# EAGLE schematic H-API_SVF (EAGLE 9.1.3)
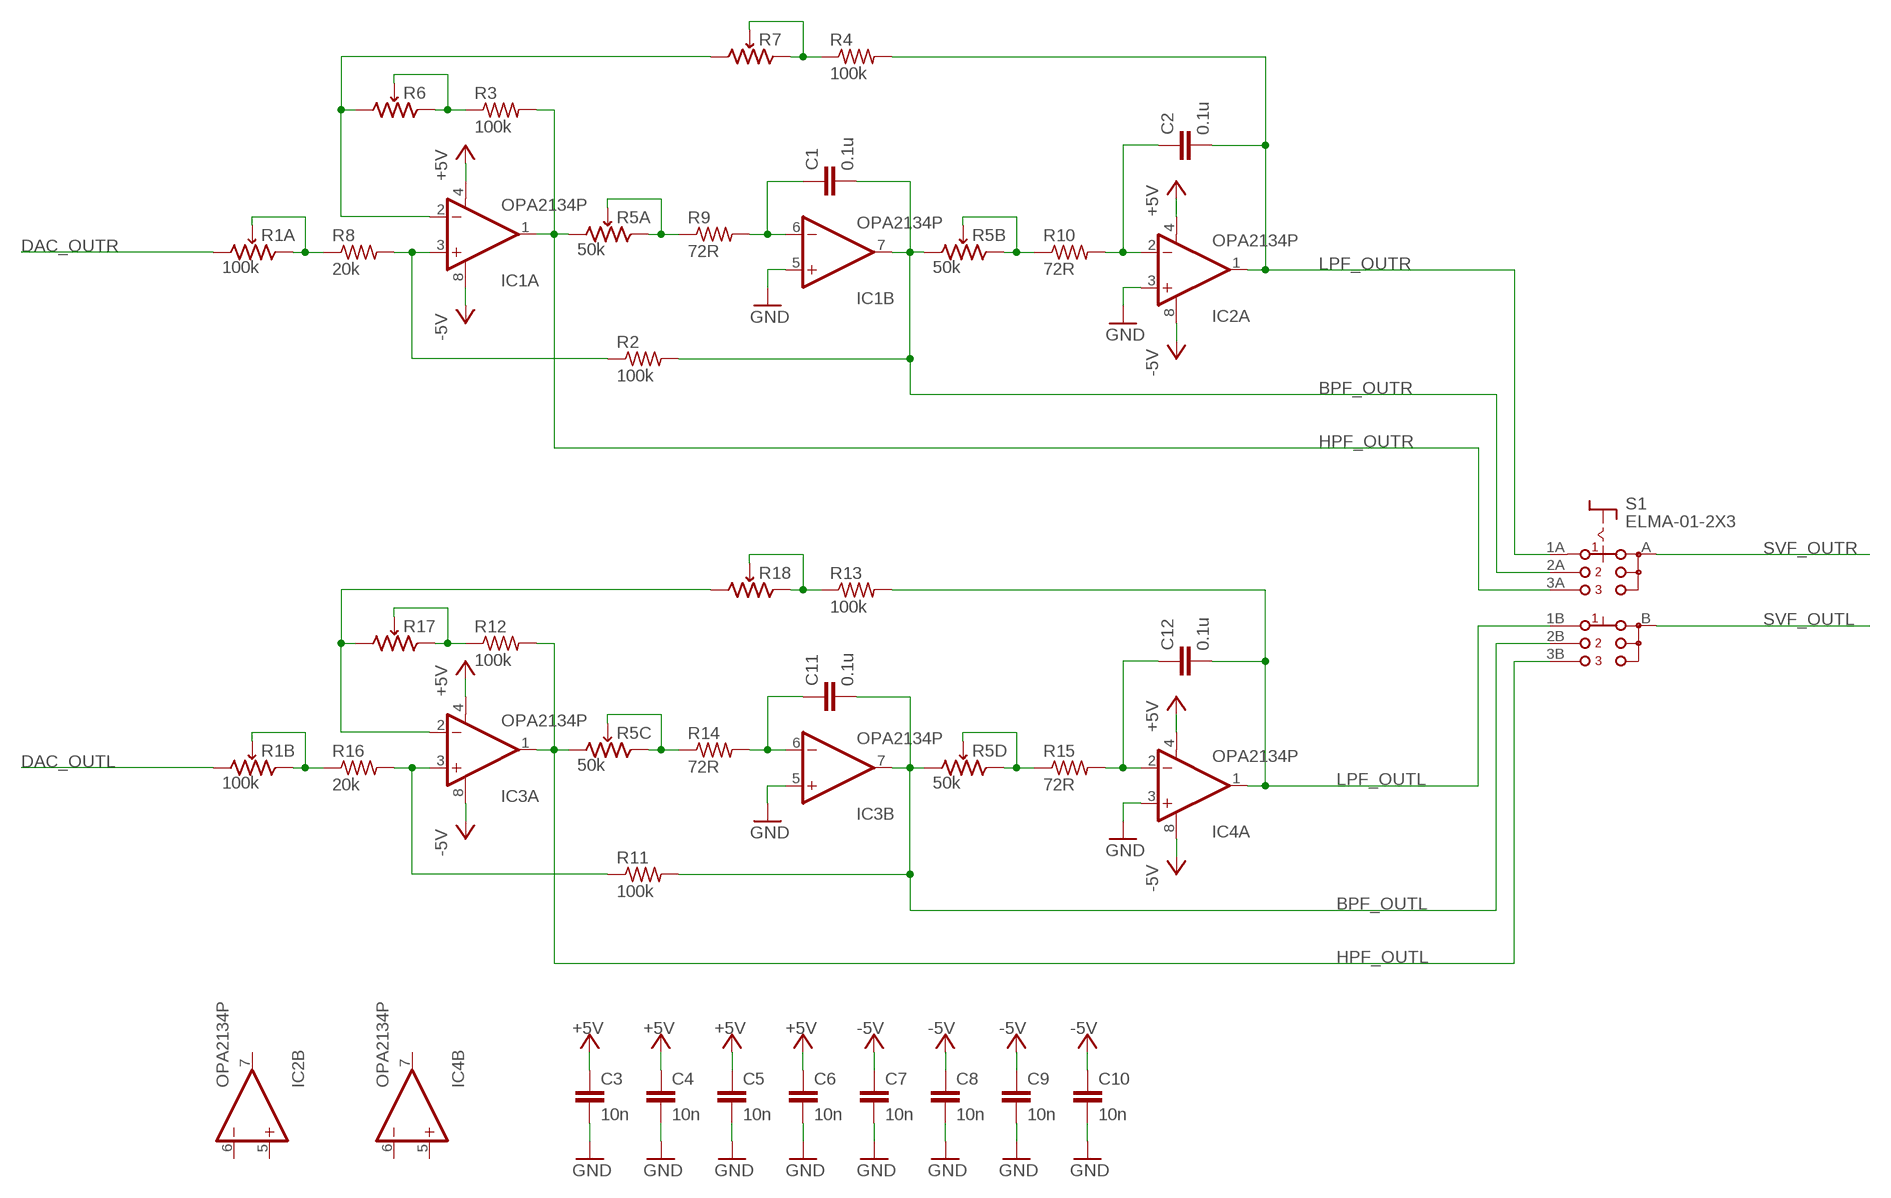
[diagram p0: schematic, sheet 1]

## Parts
C1  0.1u  C-EUC0805  [C0805]
C2  0.1u  C-EUC0805  [C0805]
C3  10n  C-EUC0805  [C0805]
C4  10n  C-EUC0805  [C0805]
C5  10n  C-EUC0805  [C0805]
C6  10n  C-EUC0805  [C0805]
C7  10n  C-EUC0805  [C0805]
C8  10n  C-EUC0805  [C0805]
C9  10n  C-EUC0805  [C0805]
C10  10n  C-EUC0805  [C0805]
C11  0.1u  C-EUC0805  [C0805]
C12  0.1u  C-EUC0805  [C0805]
IC1  OPA2134P  [DIL08]
IC2  OPA2134P  [DIL08]
IC3  OPA2134P  [DIL08]
IC4  OPA2134P  [DIL08]
R1  100k  PTR902-2015F-C104  [POT2-SW]
R2  100k  R-US_VMTA55  [VMTA55]
R3  100k  R-US_VMTA55  [VMTA55]
R4  100k  R-US_VMTA55  [VMTA55]
R5  50k  PTD904-2015K-C503  [POT4]
R6  TRIM-POT  [CT6]
R7  TRIM-POT  [CT6]
R8  20k  R-US_VMTA55  [VMTA55]
R9  72R  R-US_VMTA55  [VMTA55]
R10  72R  R-US_VMTA55  [VMTA55]
R11  100k  R-US_VMTA55  [VMTA55]
R12  100k  R-US_VMTA55  [VMTA55]
R13  100k  R-US_VMTA55  [VMTA55]
R14  72R  R-US_VMTA55  [VMTA55]
R15  72R  R-US_VMTA55  [VMTA55]
R16  20k  R-US_VMTA55  [VMTA55]
R17  TRIM-POT  [CT6]
R18  TRIM-POT  [CT6]
S1  ELMA-01-2X3  [ELMA-01-2X3]

## Nets
+5V: C3.1 C4.1 C5.1 C6.1 IC1.4(A:V-) IC2.4(A:V-) IC3.4(A:V-) IC4.4(A:V-)
-5V: C7.1 C8.1 C9.1 C10.1 IC1.8(A:V+) IC2.8(A:V+) IC3.8(A:V+) IC4.8(A:V+)
BPF_OUTL: C11.2 IC3.7(B:OUT) R5.4A R11.2 S1.2B(B2)
BPF_OUTR: C1.2 IC1.7(B:OUT) R2.2 R5.2A S1.2A(A2)
DAC_OUTL: R1.2A
DAC_OUTR: R1.1A
GND: C3.2 C4.2 C5.2 C6.2 C7.2 C8.2 C9.2 C10.2 IC1.5(B:+IN) IC2.3(A:+IN) IC3.5(B:+IN) IC4.3(A:+IN)
HPF_OUTL: IC3.1(A:OUT) R5.3A R12.2 S1.3B(B3)
HPF_OUTR: IC1.1(A:OUT) R3.2 R5.1A S1.3A(A3)
LPF_OUTL: C12.2 IC4.1(A:OUT) R13.2 S1.1B(B1)
LPF_OUTR: C2.2 IC2.1(A:OUT) R4.2 S1.1A(A1)
N$1: IC1.3(A:+IN) R2.1 R8.2
N$2: R1.2E R1.2S R16.1
N$3: R1.1E R1.1S R8.1
N$4: C2.1 IC2.2(A:-IN) R10.2
N$5: C1.1 IC1.6(B:-IN) R9.2
N$6: IC3.3(A:+IN) R11.1 R16.2
N$7: IC3.2(A:-IN) R17.A R18.A
N$8: R5.1E R5.1S R9.1
N$9: IC1.2(A:-IN) R6.A R7.A
N$10: R3.1 R6.E R6.S
N$12: R5.3E R5.3S R14.1
N$13: R4.1 R7.E R7.S
N$14: R5.2E R5.2S R10.1
N$15: C11.1 IC3.6(B:-IN) R14.2
N$17: R5.4E R5.4S R15.1
N$18: C12.1 IC4.2(A:-IN) R15.2
N$20: R12.1 R17.E R17.S
N$22: R13.1 R18.E R18.S
SVF_OUTL: S1.B
SVF_OUTR: S1.A
Unconnected: IC2.5(B:+IN) IC2.6(B:-IN) IC2.7(B:OUT) IC4.5(B:+IN) IC4.6(B:-IN) IC4.7(B:OUT) R1.3A R1.3B

## Library data of the parts
C1-C12 = rcl:C-EU: CAPACITOR, European symbol; SPICEPREFIX: C
IC1-IC4 = burr-brown:OPA2134: Operational Amplifier; MF: TEXAS INSTRUMENTS; MPN: OPA2134PA; OC_FARNELL: 1097574; OC_NEWARK: 74K3897
R1 = CapstoneLib:PTR902-2015F-C104
R2-R4 R8-R16 = rcl:R-US_: RESISTOR, American symbol; SPICEPREFIX: R
R5 = CapstoneLib:PTD904-2015K-C503
R6 R7 R17 R18 = CapstoneLib:TRIM-POT
S1 = switch:ELMA-01-2X3: Rotary Switches Type 01 Source: http://www.elma.com/files/products/rotary_components/pdfs/rotary_switches_type_01_002.pdf